# Altium schematic sheet LCD_Connector.SchDoc
size 311 x 223 mm
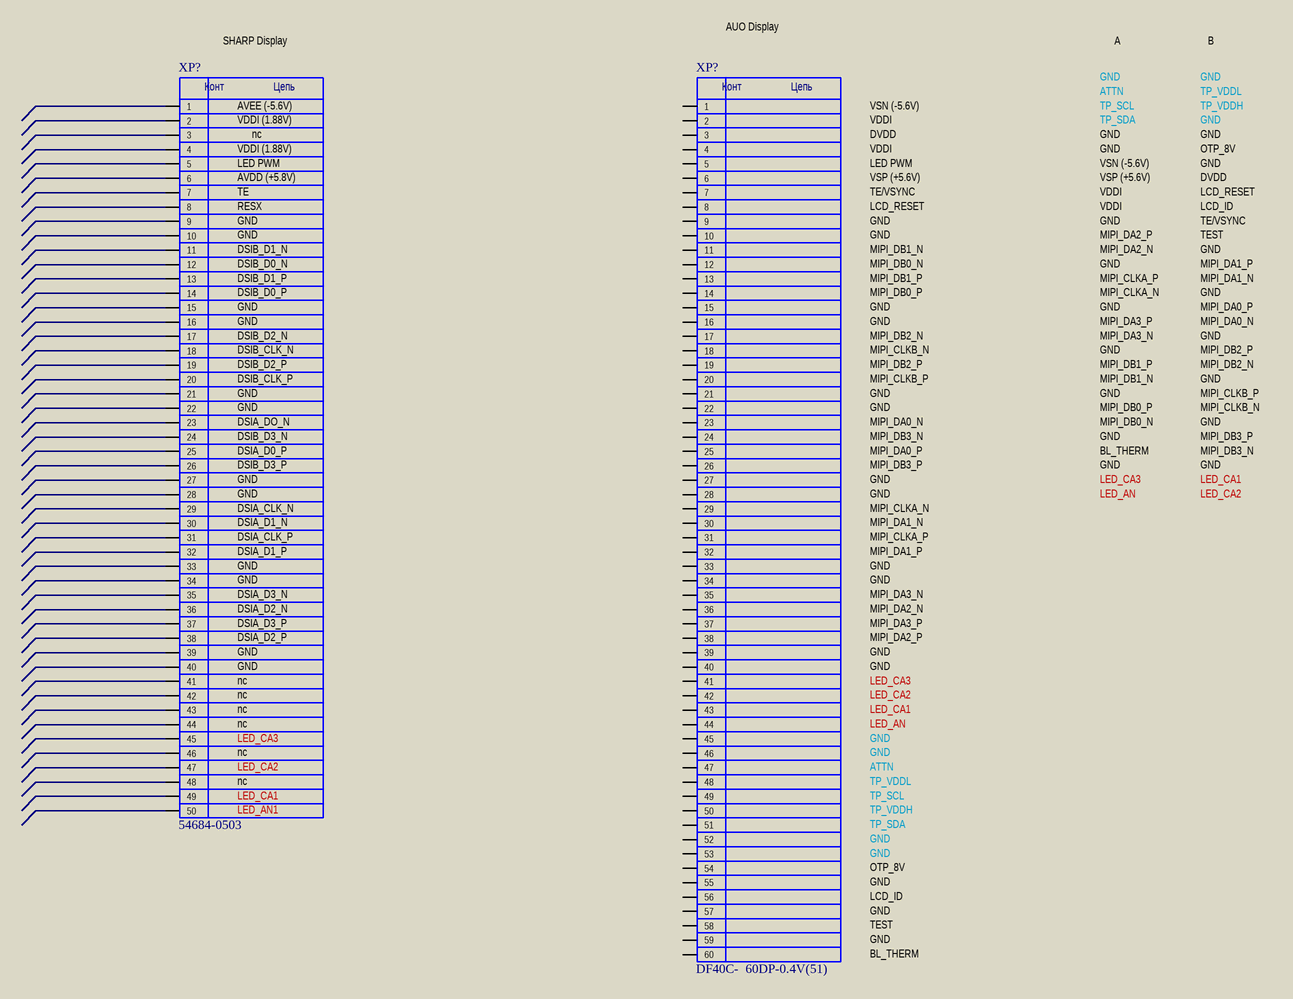
[diagram p0: LCD_Connector.SchDoc]

## Parts
(Parts that share a designator on the sheet are numbered #1, #2 ... from top to bottom, then left to right.)
XP?#1  CON_50  [54684-0503]  (value not drawn)
XP?#2  CON_60  [DF40C-  60DP-0.4V(51)]  (value not drawn)

## Nets

Not connected (* = marked no-connect by the designer): XP?#1 1 2 3 4 5 6 7 8 9 10 11 12 13 14 15 16 17 18 19 20 21 22 23 24 25 26 27 28 29 30 31 32 33 34 35 36 37 38 39 40 41 42 43 44 45 46 47 48 49 50; XP?#2 1 2 3 4 5 6 7 8 9 10 11 12 13 14 15 16 17 18 19 20 21 22 23 24 25 26 27 28 29 30 31 32 33 34 35 36 37 38 39 40 41 42 43 44 45 46 47 48 49 50 51 52 53 54 55 56 57 58 59 60

## Notes on the sheet
- SHARP Display
- AUO Display
- GND
- A
- B
- AVEE (-5.6V)
- VDDI (1.88V)
- LED PWM
- nc
- VSN (-5.6V)
- VDDI
- DVDD
- ATTN
- TP_SCL
- TP_SDA
- TP_VDDL
- TP_VDDH
- OTP_8V
- AVDD (+5.8V)
- TE
- RESX
- VSP (+5.6V)
- LCD_RESET
- TE/VSYNC
- LCD_ID
- DSIB_D1_N
- DSIB_D0_N
- DSIB_D1_P
- DSIB_D0_P
- MIPI_DB1_P
- MIPI_DB1_N
- MIPI_DB0_P
- MIPI_DB0_N
- MIPI_DA2_P
- MIPI_DA2_N
- MIPI_CLKA_P
- MIPI_CLKA_N
- TEST
- MIPI_DA1_P
- MIPI_DA1_N
- MIPI_DA0_P
- DSIB_D2_N
- DSIB_CLK_N
- DSIB_D2_P
- MIPI_DB2_P
- MIPI_DB2_N
- MIPI_CLKB_N
- MIPI_DA3_P
- MIPI_DA3_N
- MIPI_DA0_N
- DSIB_CLK_P
- DSIA_DO_N
- DSIB_D3_N
- DSIA_D0_P
- MIPI_CLKB_P
- MIPI_DB3_N
- BL_THERM
- MIPI_DB3_P
- DSIB_D3_P
- DSIA_CLK_N
- LED_CA3
- LED_AN
- LED_CA1
- LED_CA2
- DSIA_D1_N
- DSIA_CLK_P
- DSIA_D1_P
- DSIA_D3_N
- DSIA_D2_N
- DSIA_D3_P
- DSIA_D2_P
- LED_AN1
- Перв. примен.
- М. экспертиза
- Справ. №
- Подп. и дата
- Инв. № дубл.
- Взам. инв. №
- Изм.
- Разраб.
- Лист.
- № докум.
- Подп.
- Дата
- Лит.
- Масса
- Масш.
- Инв. № подп.
- Пров.
- Т. контр.
- Н. контр.
- Утв.
- Схема электрическая
- принципиальная
- Лист
- Листов
- Копировал
- Формат А2
- (in symbol CON_50) Конт; Цепь
- (in symbol CON_60) Конт; Цепь

## Library data of the parts
XP?#1 = CON_50: SlimStack 0.40mm Pitch Board-to-Board Connectors; Name: 54684-0503
XP?#2 = CON_60: Name: DF40C-  60DP-0.4V(51)